# EAGLE schematic Water Pump Control System (EAGLE 9.4.2)
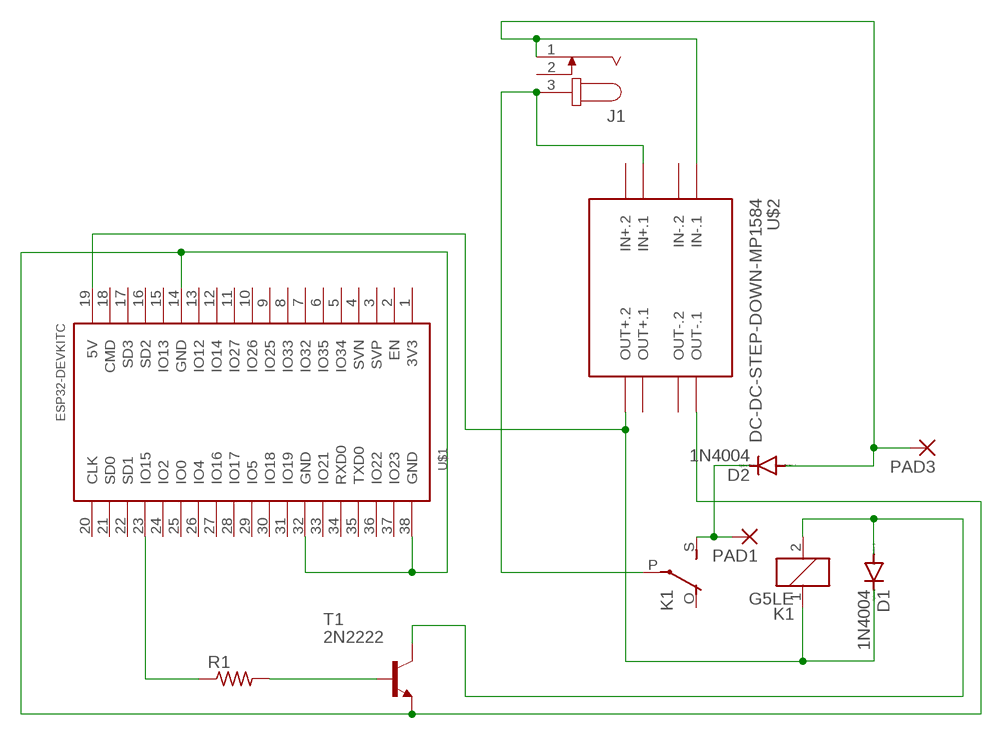
[diagram p0: schematic, sheet 1]

## Parts
D1  1N4004  [DO41-10]
D2  1N4004  [DO41-10]
J1  JACK-PLUG1  [SPC4078]
K1  G5LE  [G5LE]
PAD1  1,6/0,8  [1,6/0,8]
PAD3  1,6/0,8  [1,6/0,8]
R1  R-US_0207/10  [0207/10]
T1  2N2222  [TO92-EBC-OVAL]
U$1  ESP32DEVKITC  [ESP32-DEVKITC]
U$2  DC-DC-STEP-DOWN-MP1584  [DC-DC-STEP-DOWN-MP1584]

## Nets
N$1: R1.2 T1.B
N$2: R1.1 U$1.23(IO15)
N$5: D2.C K1.S(2:S) PAD1.1(P)
N$6: D1.A K1.2 T1.C
N$7: T1.E U$1.14(GND) U$1.32(GND) U$1.38(GND) U$2.OUT-.1
N$8: J1.3 K1.P(2:P) U$2.IN+.1
N$10: D2.A J1.1 PAD3.1(P) U$2.IN-.1
N$11: D1.C K1.1 U$1.19(5V) U$2.OUT+.2
Unconnected: J1.2 K1.O(2:O) U$1.1(3V3) U$1.2(EN) U$1.3(SVP) U$1.4(SVN) U$1.5(IO34) U$1.6(IO35) U$1.7(IO32) U$1.8(IO33) U$1.9(IO25) U$1.10(IO26) U$1.11(IO27) U$1.12(IO14) U$1.13(IO12) U$1.15(IO13) U$1.16(SD2) U$1.17(SD3) U$1.18(CMD) U$1.20(CLK) U$1.21(SD0) U$1.22(SD1) U$1.24(IO2) U$1.25(IO0) U$1.26(IO4) U$1.27(IO16) U$1.28(IO17) U$1.29(IO5) U$1.30(IO18) U$1.31(IO19) U$1.33(IO21) U$1.34(RXD0) U$1.35(TXD0) U$1.36(IO22) U$1.37(IO23) U$2.IN+.2 U$2.IN-.2 U$2.OUT+.1 U$2.OUT-.2

## Library data of the parts
D1 D2 = diode:1N4004: DIODE general purpose rectifier, 1 A
J1 = con-jack:JACK-PLUG: DC POWER JACK Power Jack, DC, Right Angle, Through Hole, Rated 5A at 16VDC, PC Terminals Distributor: Farnell (www.Farnell.de) Drawing: 84N1161.pdf / 84N1162.pdf Manufacturer: SPC Technology (www.spctechnology.com) Type: SPC4077 / SPC 4078; OC_FARNELL: unknown; OC_NEWARK: unknown
K1 = relay:G5LE: RELAY 1 x switch, 10 A/120 V AC, 8 A/30 V DC, Omron; OC_FARNELL: unknown; OC_NEWARK: unknown
PAD1 PAD3 = wirepad:1,6/0,8: THROUGH-HOLE PAD
R1 = adafruit:R-US_: RESISTOR, American symbol
T1 = adafruit:2N2222: NPN TRANSISTOR Big oval pads
U$1 = GHII-ESP32-DEVKITC:ESP32DEVKITC
U$2 = GHIdiy-modules:DC-DC-STEP-DOWN-MP1584: DC/DC Step-Down Regulator based on MP1584 chip MP1584 datasheet available here: http://www.haoyuelectronics.com/Attachment/MP1584/MP1584.pdf Click here to find device on ebay.com <http://www.ebay.com/sch/mp1584+module>

## Net classes
0 default: width 1.016 mm, drill 1.016 mm, clearance 0.889 mm